# Altium project EXCHANGEDISPLAY.PRJPCB
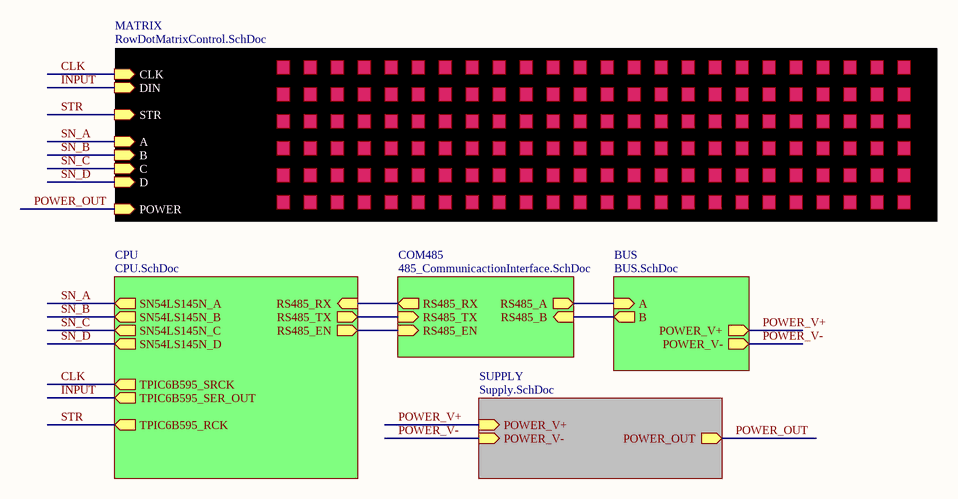
[diagram p0: ExchangeDisplay.SchDoc]
10 sheets, 256 parts. Net scope: hierarchical (ports join the sheet entries above them; power ports are global).
Board file: BAZ-DOTMATRIX-01R03.PcbDoc
Sheets:
  ExchangeDisplay.SchDoc
    CPU = CPU.SchDoc
    COM485 = 485_CommunicactionInterface.SchDoc
    MATRIX = RowDotMatrixControl.SchDoc
      RowCtrl = SN54LS145N_CommunicationInterface.SchDoc
      Row = RowDotMatrix.SchDoc
      Row = RowDotMatrix.SchDoc
      Row = RowDotMatrix.SchDoc
      Row = RowDotMatrix.SchDoc
      Row = RowDotMatrix.SchDoc
      Row = RowDotMatrix.SchDoc
      Row = RowDotMatrix.SchDoc
      REG = TPIC6B595_CommunicationInterface.SchDoc
      REG = TPIC6B595_CommunicationInterface.SchDoc
      REG = TPIC6B595_CommunicationInterface.SchDoc
    BUS = BUS.SchDoc
      BUS = BUSConnector.SchDoc
      BUS = BUSConnector.SchDoc
    SUPPLY = Supply.SchDoc

## Sheet ExchangeDisplay.SchDoc
size A4

### Sub-sheets
BUS = BUS.SchDoc: A (in), B (out), POWER_V+ (out), POWER_V- (out)
COM485 = 485_CommunicactionInterface.SchDoc: RS485_RX (out), RS485_TX (in), RS485_EN (in), RS485_A (out), RS485_B (in)
CPU = CPU.SchDoc: RS485_RX (in), RS485_TX (out), RS485_EN (out), TPIC6B595_SRCK (out), TPIC6B595_SER_OUT (out), TPIC6B595_RCK (out), SN54LS145N_A (out), SN54LS145N_B (out), SN54LS145N_C (out), SN54LS145N_D (out)
MATRIX = RowDotMatrixControl.SchDoc: CLK (in), DIN (in), STR (in), POWER (in), A (in), B (in), C (in), D (in)
SUPPLY = Supply.SchDoc: POWER_V+ (in), POWER_V- (in), POWER_OUT (out)

### Nets
A: sheet COM485/RS485_A, sheet BUS/A
B: sheet COM485/RS485_B, sheet BUS/B
CLK: sheet CPU/TPIC6B595_SRCK, sheet MATRIX/CLK
COM_485_EN: sheet CPU/RS485_EN, sheet COM485/RS485_EN
DI: sheet CPU/RS485_TX, sheet COM485/RS485_TX
INPUT: sheet CPU/TPIC6B595_SER_OUT, sheet MATRIX/DIN
POWER_OUT: sheet MATRIX/POWER, sheet SUPPLY/POWER_OUT  [project net EXTSUPP]
POWER_V+: sheet BUS/POWER_V+, sheet SUPPLY/POWER_V+
POWER_V-: sheet BUS/POWER_V-, sheet SUPPLY/POWER_V-
RO: sheet CPU/RS485_RX, sheet COM485/RS485_RX
SN_A: sheet CPU/SN54LS145N_A, sheet MATRIX/A  [project net PIN_A]
SN_B: sheet CPU/SN54LS145N_B, sheet MATRIX/B  [project net PIN_B]
SN_C: sheet CPU/SN54LS145N_C, sheet MATRIX/C  [project net PIN_C]
SN_D: sheet CPU/SN54LS145N_D, sheet MATRIX/D  [project net PIN_D]
STR: sheet CPU/TPIC6B595_RCK, sheet MATRIX/STR  [project net RCK]

## Sheet CPU.SchDoc
size A4
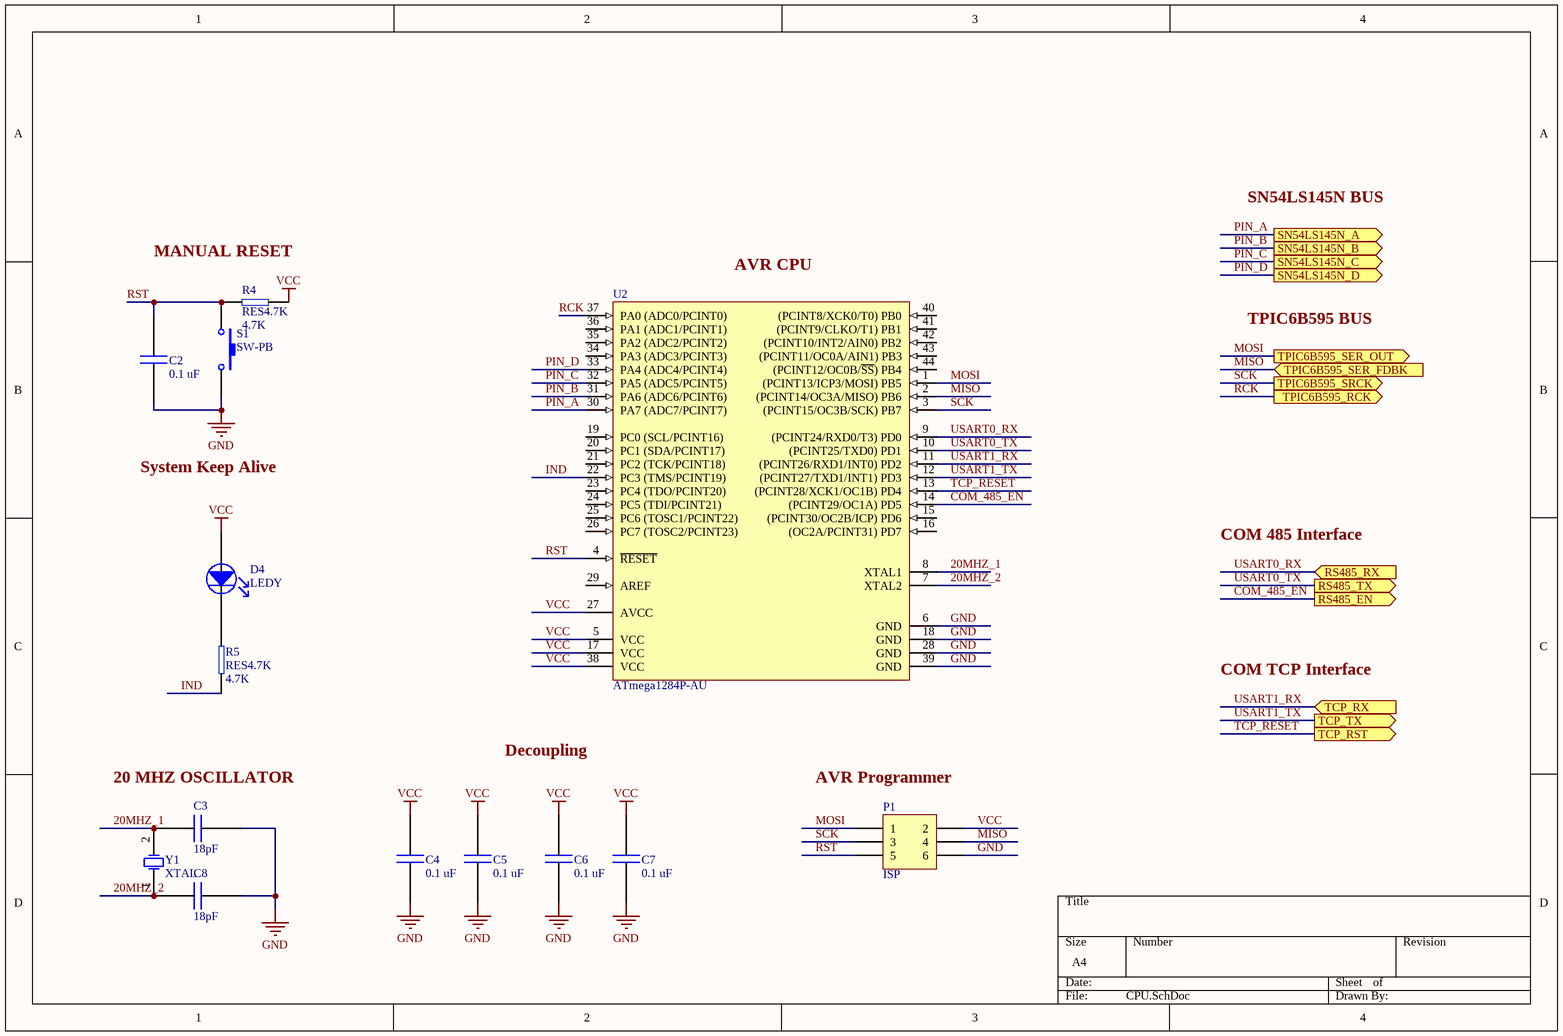
[diagram p1: CPU.SchDoc]

### Parts
C2  value 0.1 uF  [CAP0603]  (hidden comment: CAP0.1uF)
C3  value 18pF  [CAP0603]  (hidden comment: CAP18pF)
C4  value 0.1 uF  [CAP0603]  (hidden comment: CAP0.1uF)
C5  value 0.1 uF  [CAP0603]  (hidden comment: CAP0.1uF)
C6  value 0.1 uF  [CAP0603]  (hidden comment: CAP0.1uF)
C7  value 0.1 uF  [CAP0603]  (hidden comment: CAP0.1uF)
C8  value 18pF  [CAP0603]  (hidden comment: CAP18pF)
D4  LEDY  [150060YS75000]
P1  ISP  [HDR2X3]
R4  RES4.7K  value 4.7K  [RES0603]
R5  RES4.7K  value 4.7K  [RES0603]
S1  SW-PB  [microswitch]
U2  ATmega1284P-AU  [44A_N]
Y1  XTAL  [Crystal20MHz]

### Ports
RS485_EN (out), RS485_RX (in), RS485_TX (out), SN54LS145N_A (out), SN54LS145N_B (out), SN54LS145N_C (out), SN54LS145N_D (out), TCP_RST (out), TCP_RX (in), TCP_TX (out), TPIC6B595_RCK (out), TPIC6B595_SER_FDBK (in), TPIC6B595_SER_OUT (out), TPIC6B595_SRCK (out)

### Nets
GND: C2.2 C3.2 C4.2 C5.2 C6.2 C7.2 C8.2 P1.6 S1.2 U2.6(GND) U2.18(GND) U2.28(GND) U2.39(GND)
VCC: C4.1 C5.1 C6.1 C7.1 D4.2(Anode) P1.2 R4.2(neg) U2.5(VCC) U2.17(VCC) U2.27(AVCC) U2.38(VCC)
20MHZ_1: C3.1 U2.8(XTAL1) Y1.2(OSC2)
20MHZ_2: C8.1 U2.7(XTAL2) Y1.1(OSC1)
COM_485_EN: U2.14((PCINT29/OC1A)_PD5) ; port RS485_EN
IND: R5.1(pos) U2.22(PC3_(TMS/PCINT19))
MISO: P1.4 U2.2((PCINT14/OC3A/MISO)_PB6) ; port TPIC6B595_SER_FDBK
MOSI: P1.1 U2.1((PCINT13/ICP3/MOSI)_PB5) ; port TPIC6B595_SER_OUT  [project net INPUT]
PIN_A: U2.30(PA7_(ADC7/PCINT7)) ; port SN54LS145N_A
PIN_B: U2.31(PA6_(ADC6/PCINT6)) ; port SN54LS145N_B
PIN_C: U2.32(PA5_(ADC5/PCINT5)) ; port SN54LS145N_C
PIN_D: U2.33(PA4_(ADC4/PCINT4)) ; port SN54LS145N_D
RCK: U2.37(PA0_(ADC0/PCINT0)) ; port TPIC6B595_RCK
RST: C2.1 P1.5 R4.1(pos) S1.1 U2.4(~{RESET})
SCK: P1.3 U2.3((PCINT15/OC3B/SCK)_PB7) ; port TPIC6B595_SRCK  [project net CLK]
TCP_RESET: U2.13((PCINT28/XCK1/OC1B)_PD4) ; port TCP_RST
USART0_RX: U2.9((PCINT24/RXD0/T3)_PD0) ; port RS485_RX  [project net RO]
USART0_TX: U2.10((PCINT25/TXD0)_PD1) ; port RS485_TX  [project net DI]
USART1_RX: U2.11((PCINT26/RXD1/INT0)_PD2) ; port TCP_RX
USART1_TX: U2.12((PCINT27/TXD1/INT1)_PD3) ; port TCP_TX
NetD4_1: D4.1(Cathode) R5.2(neg)

Not connected (* = marked no-connect by the designer): U2 15((PCINT30/OC2B/ICP)_PD6) 16((OC2A/PCINT31)_PD7) 19(PC0_(SCL/PCINT16)) 20(PC1_(SDA/PCINT17)) 21(PC2_(TCK/PCINT18)) 23(PC4_(TDO/PCINT20)) 24(PC5_(TDI/PCINT21)) 25(PC6_(TOSC1/PCINT22)) 26(PC7_(TOSC2/PCINT23)) 29(AREF) 34(PA3_(ADC3/PCINT3)) 35(PA2_(ADC2/PCINT2)) 36(PA1_(ADC1/PCINT1)) 40((PCINT8/XCK0/T0)_PB0) 41((PCINT9/CLKO/T1)_PB1) 42((PCINT10/INT2/AIN0)_PB2) 43((PCINT11/OC0A/AIN1)_PB3) 44((PCINT12/OC0B/~{SS})_PB4)

### Notes on the sheet
- Labels drawn without touching a wire or pin: 20 MHZ OSCILLATOR, AVR CPU, AVR Programmer, COM 485 Interface, COM TCP Interface, Decoupling, MANUAL RESET, SN54LS145N BUS, System Keep Alive, TPIC6B595 BUS

### Library data of the parts
C2 C4-C7 = C0.1UF: Capacitores cerámicos de capas múltiples (MLCC) - SMD/SMT 0603 0.1uF 16volts X7R 5%; MPN: VJ0603Y104JXJPW1BC; Supplier PN: 77-VJ0603Y104JXJPBC; Supplier: Mouser
C3 C8 = CAP18pF: Capacitores cerámicos de capas múltiples (MLCC) - SMD/SMT 0603 18pF 50volts C0G 5%; MPN: GRM1885C1H180JA01D; Supplier: Mouser; Supplier PN: 81-GRM39C180J50
D4 = LEDY: LED estándar - SMD (montaje superficial) WL-SMCW SMDMono TpVw Waterclr 0603 Yellow; Supplier: Mouser; Supplier PN: 710-150060YS75000; MPN: 150060YS75000; Value: Yellow
P1 = Header 3X2: Alojamientos de cables y cabecera 2X03P DUAL ROW; MPN: 826925-3; Value: 6 POS; Supplier: Mouser; Supplier PN: 571-826925-3
R4 R5 = RES4.7K: Resistores de película gruesa - SMD 1/10watt 4.7Kohms 1%; MPN: CRCW06034K70FKEA; Supplier PN: 71-CRCW0603-4.7K-E3; Supplier: Mouser
S1 = SW-PB: Switch; MPN: PTS635SL43SMTR LFS; Value: OFF - (ON); Supplier: Mouser; Supplier PN: 611-PTS635SL43SMTRLF
U2 = ATmega1284P-AU: 20 MHz 8-bit AVR Microcontroller with 128KB Flash, 44-Pin TQFP Pkg, Industrial Temp; Supplier: Mouser; Supplier PN: 556-ATMEGA1284P-AU; MPN: ATMEGA1284P-AU; Value: ATMEGA1284P
Y1 = XTAL: Cristales 20MHz 16pF -10C +70C; MPN: ECS-200-16-5PX-TR; Supplier: Mouser; Supplier PN: 520-ECS-200-16-5PX-T; Value: 20 MHz

## Sheet 485_CommunicactionInterface.SchDoc
size A4
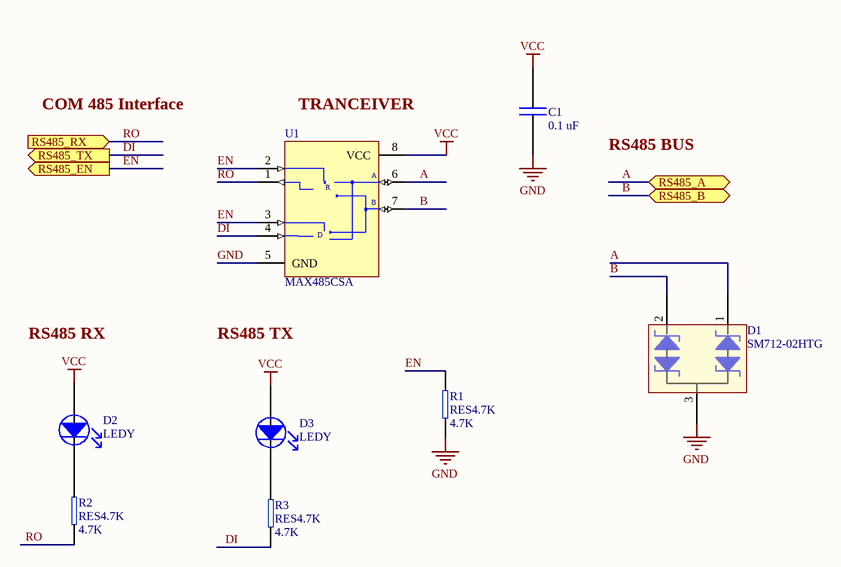
[diagram p2: 485_CommunicactionInterface.SchDoc]

### Parts
C1  value 0.1 uF  [CAP0603]  (hidden comment: CAP0.1uF)
D1  SM712-02HTG  [SW712]
D2  LEDY  [150060YS75000]
D3  LEDY  [150060YS75000]
R1  RES4.7K  value 4.7K  [RES0603]
R2  RES4.7K  value 4.7K  [RES0603]
R3  RES4.7K  value 4.7K  [RES0603]
U1  MAX485CSA  [NSO8_N]

### Ports
RS485_A (bidir), RS485_B (bidir), RS485_EN (out), RS485_RX (in), RS485_TX (out)

### Nets
GND: C1.2 D1.3 R1.2(neg) U1.5(GND)
VCC: C1.1 D2.2(Anode) D3.2(Anode) U1.8(VCC)
A: D1.1 U1.6(A) ; port RS485_A
B: D1.2 U1.7(B) ; port RS485_B
DI: R3.2(neg) U1.4(DI) ; port RS485_TX
EN: R1.1(pos) U1.2(~{RE}) U1.3(DE) ; port RS485_EN  [project net COM_485_EN]
RO: R2.2(neg) U1.1(RO) ; port RS485_RX
NetD2_1: D2.1(Cathode) R2.1(pos)
NetD3_1: D3.1(Cathode) R3.1(pos)

### Notes on the sheet
- Labels drawn without touching a wire or pin: COM 485 Interface, RS485 BUS, RS485 RX, RS485 TX, TRANCEIVER
- (in symbol MAX485CSA) R; D

### Library data of the parts
C1 = C0.1UF: as C2 on sheet CPU; Supplier PN: 77-VJ0603Y104JXJPBC; Supplier: Mouser
D1 = SM712-02HTG: Secuencias de diodos de TVS 600W 2 Channel Green Asymmetrical SOT23-3 (- 7 V to + 12 V); Supplier: Mouser; Supplier PN: 576-SM712-02HTG; MPN: SM712-02HTG; Value: TVS 600W
D2 D3 = LEDY: as D4 on sheet CPU; Supplier: Mouser; Supplier PN: 710-150060YS75000; MPN: 150060YS75000; Value: Yellow
R1-R3 = RES4.7K: as R4 on sheet CPU; Supplier PN: 71-CRCW0603-4.7K-E3; Supplier: Mouser
U1 = MAX485CSA: Low-Power, Slew-Rate-Limited RS-485/RS-422 Transceiver; MPN: MAX485CSA+; Value: RS485; Supplier: Mouser; Supplier PN: 700-MAX485CSA

## Sheet RowDotMatrixControl.SchDoc
size A4
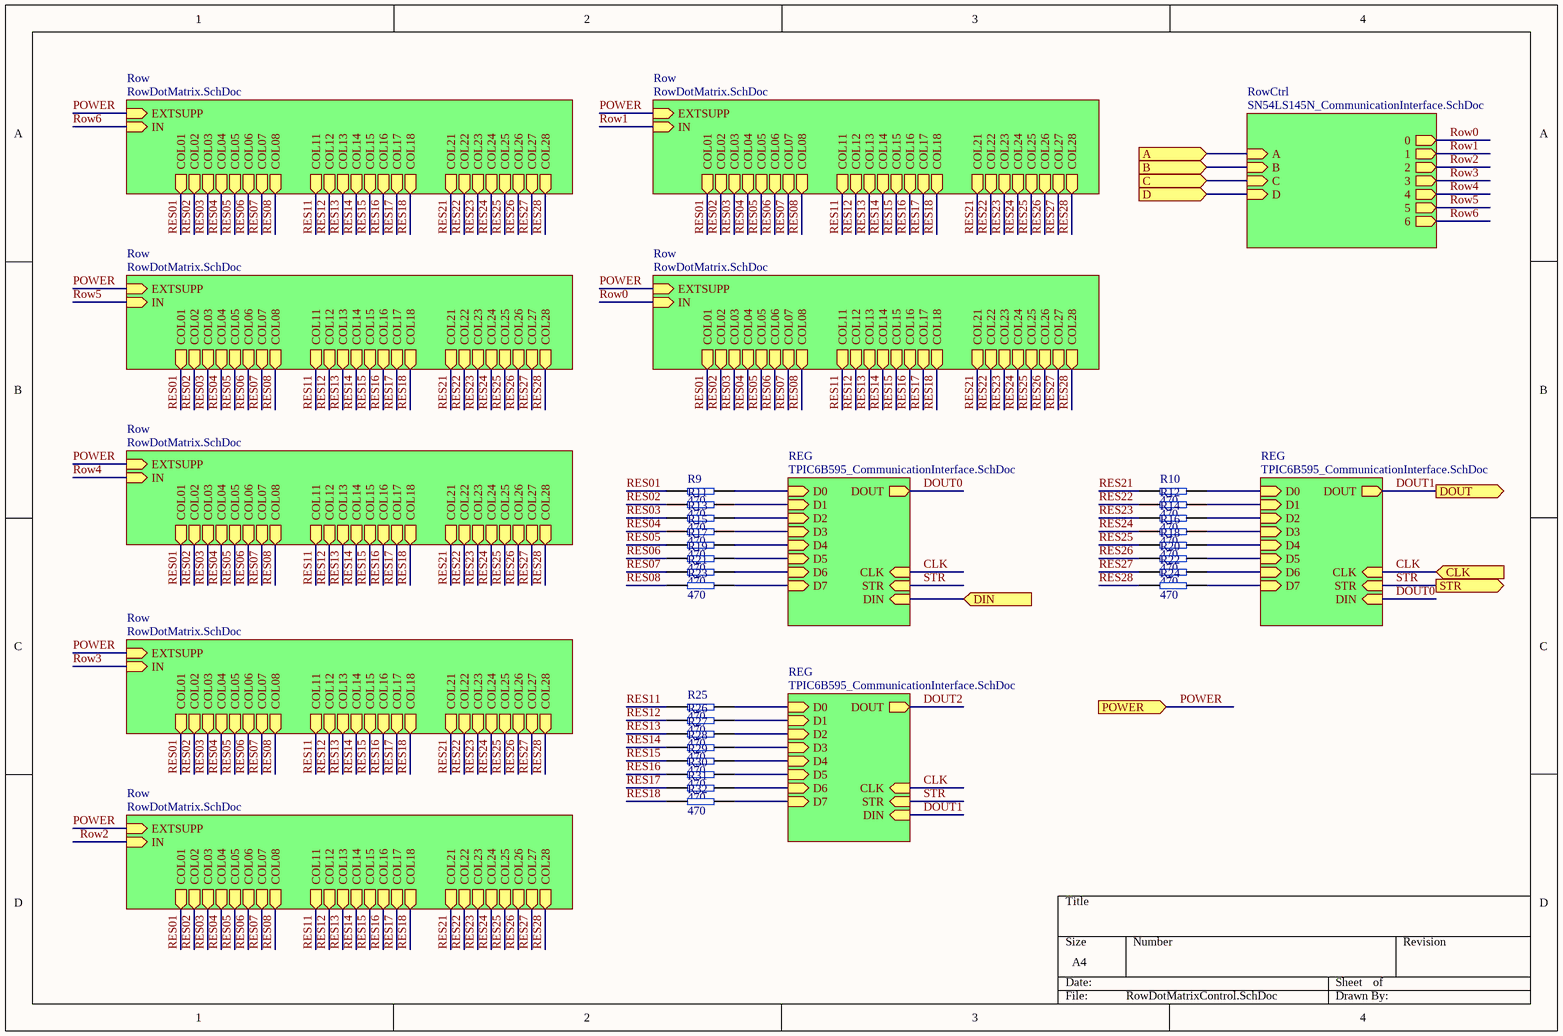
[diagram p3: RowDotMatrixControl.SchDoc]

### Parts
R9  value 470  [RES2512]  (hidden comment: RES470)
R10  value 470  [RES2512]  (hidden comment: RES470)
R11  value 470  [RES2512]  (hidden comment: RES470)
R12  value 470  [RES2512]  (hidden comment: RES470)
R13  value 470  [RES2512]  (hidden comment: RES470)
R14  value 470  [RES2512]  (hidden comment: RES470)
R15  value 470  [RES2512]  (hidden comment: RES470)
R16  value 470  [RES2512]  (hidden comment: RES470)
R17  value 470  [RES2512]  (hidden comment: RES470)
R18  value 470  [RES2512]  (hidden comment: RES470)
R19  value 470  [RES2512]  (hidden comment: RES470)
R20  value 470  [RES2512]  (hidden comment: RES470)
R21  value 470  [RES2512]  (hidden comment: RES470)
R22  value 470  [RES2512]  (hidden comment: RES470)
R23  value 470  [RES2512]  (hidden comment: RES470)
R24  value 470  [RES2512]  (hidden comment: RES470)
R25  value 470  [RES2512]  (hidden comment: RES470)
R26  value 470  [RES2512]  (hidden comment: RES470)
R27  value 470  [RES2512]  (hidden comment: RES470)
R28  value 470  [RES2512]  (hidden comment: RES470)
R29  value 470  [RES2512]  (hidden comment: RES470)
R30  value 470  [RES2512]  (hidden comment: RES470)
R31  value 470  [RES2512]  (hidden comment: RES470)
R32  value 470  [RES2512]  (hidden comment: RES470)

### Sub-sheets
REG = TPIC6B595_CommunicationInterface.SchDoc: D0 (in), D1 (in), D2 (in), D3 (in), D4 (in), D5 (in), D6 (in), D7 (in), DIN (in), DOUT (out), STR (in), CLK (in)
REG = TPIC6B595_CommunicationInterface.SchDoc: D0 (in), D1 (in), D2 (in), D3 (in), D4 (in), D5 (in), D6 (in), D7 (in), DIN (in), DOUT (out), STR (in), CLK (in)
REG = TPIC6B595_CommunicationInterface.SchDoc: D0 (in), D1 (in), D2 (in), D3 (in), D4 (in), D5 (in), D6 (in), D7 (in), DIN (in), DOUT (out), STR (in), CLK (in)
Row = RowDotMatrix.SchDoc: EXTSUPP (in), COL01 (out), COL02 (out), COL03 (out), COL04 (out), COL05 (out), COL06 (out), COL07 (out), COL08 (out), COL11 (out), COL12 (out), COL13 (out), COL14 (out), COL15 (out), COL16 (out), COL17 (out), COL18 (out), COL21 (out), COL22 (out), COL23 (out), COL24 (out), COL25 (out), COL26 (out), COL27 (out), COL28 (out), IN (in)
Row = RowDotMatrix.SchDoc: EXTSUPP (in), COL01 (out), COL02 (out), COL03 (out), COL04 (out), COL05 (out), COL06 (out), COL07 (out), COL08 (out), COL11 (out), COL12 (out), COL13 (out), COL14 (out), COL15 (out), COL16 (out), COL17 (out), COL18 (out), COL21 (out), COL22 (out), COL23 (out), COL24 (out), COL25 (out), COL26 (out), COL27 (out), COL28 (out), IN (in)
Row = RowDotMatrix.SchDoc: EXTSUPP (in), COL01 (out), COL02 (out), COL03 (out), COL04 (out), COL05 (out), COL06 (out), COL07 (out), COL08 (out), COL11 (out), COL12 (out), COL13 (out), COL14 (out), COL15 (out), COL16 (out), COL17 (out), COL18 (out), COL21 (out), COL22 (out), COL23 (out), COL24 (out), COL25 (out), COL26 (out), COL27 (out), COL28 (out), IN (in)
Row = RowDotMatrix.SchDoc: EXTSUPP (in), COL01 (out), COL02 (out), COL03 (out), COL04 (out), COL05 (out), COL06 (out), COL07 (out), COL08 (out), COL11 (out), COL12 (out), COL13 (out), COL14 (out), COL15 (out), COL16 (out), COL17 (out), COL18 (out), COL21 (out), COL22 (out), COL23 (out), COL24 (out), COL25 (out), COL26 (out), COL27 (out), COL28 (out), IN (in)
Row = RowDotMatrix.SchDoc: EXTSUPP (in), COL01 (out), COL02 (out), COL03 (out), COL04 (out), COL05 (out), COL06 (out), COL07 (out), COL08 (out), COL11 (out), COL12 (out), COL13 (out), COL14 (out), COL15 (out), COL16 (out), COL17 (out), COL18 (out), COL21 (out), COL22 (out), COL23 (out), COL24 (out), COL25 (out), COL26 (out), COL27 (out), COL28 (out), IN (in)
Row = RowDotMatrix.SchDoc: EXTSUPP (in), COL01 (out), COL02 (out), COL03 (out), COL04 (out), COL05 (out), COL06 (out), COL07 (out), COL08 (out), COL11 (out), COL12 (out), COL13 (out), COL14 (out), COL15 (out), COL16 (out), COL17 (out), COL18 (out), COL21 (out), COL22 (out), COL23 (out), COL24 (out), COL25 (out), COL26 (out), COL27 (out), COL28 (out), IN (in)
Row = RowDotMatrix.SchDoc: EXTSUPP (in), COL01 (out), COL02 (out), COL03 (out), COL04 (out), COL05 (out), COL06 (out), COL07 (out), COL08 (out), COL11 (out), COL12 (out), COL13 (out), COL14 (out), COL15 (out), COL16 (out), COL17 (out), COL18 (out), COL21 (out), COL22 (out), COL23 (out), COL24 (out), COL25 (out), COL26 (out), COL27 (out), COL28 (out), IN (in)
RowCtrl = SN54LS145N_CommunicationInterface.SchDoc: A (in), B (in), C (in), D (in), 0 (out), 1 (out), 2 (out), 3 (out), 4 (out), 5 (out), 6 (out)

### Ports
A (in), B (in), C (in), CLK (in), D (in), DIN (in), DOUT (out), POWER (in), STR (out)

### Nets
CLK: port CLK, sheet REG/CLK, sheet REG/CLK, sheet REG/CLK
DOUT0: sheet REG/DOUT, sheet REG/DIN
DOUT1: port DOUT, sheet REG/DIN, sheet REG/DOUT
INPUT: port DIN, sheet REG/DIN
PIN_A: port A, sheet RowCtrl/A
PIN_B: port B, sheet RowCtrl/B
PIN_C: port C, sheet RowCtrl/C
PIN_D: port D, sheet RowCtrl/D
POWER: port POWER, sheet Row/EXTSUPP, sheet Row/EXTSUPP, sheet Row/EXTSUPP, sheet Row/EXTSUPP, sheet Row/EXTSUPP, sheet Row/EXTSUPP, sheet Row/EXTSUPP  [project net EXTSUPP]
RES01: R9.1(pos) ; sheet Row/COL01, sheet Row/COL01, sheet Row/COL01, sheet Row/COL01, sheet Row/COL01, sheet Row/COL01, sheet Row/COL01
RES02: R11.1(pos) ; sheet Row/COL02, sheet Row/COL02, sheet Row/COL02, sheet Row/COL02, sheet Row/COL02, sheet Row/COL02, sheet Row/COL02
RES03: R13.1(pos) ; sheet Row/COL03, sheet Row/COL03, sheet Row/COL03, sheet Row/COL03, sheet Row/COL03, sheet Row/COL03, sheet Row/COL03
RES04: R15.1(pos) ; sheet Row/COL04, sheet Row/COL04, sheet Row/COL04, sheet Row/COL04, sheet Row/COL04, sheet Row/COL04, sheet Row/COL04
RES05: R17.1(pos) ; sheet Row/COL05, sheet Row/COL05, sheet Row/COL05, sheet Row/COL05, sheet Row/COL05, sheet Row/COL05, sheet Row/COL05
RES06: R19.1(pos) ; sheet Row/COL06, sheet Row/COL06, sheet Row/COL06, sheet Row/COL06, sheet Row/COL06, sheet Row/COL06, sheet Row/COL06
RES07: R21.1(pos) ; sheet Row/COL07, sheet Row/COL07, sheet Row/COL07, sheet Row/COL07, sheet Row/COL07, sheet Row/COL07, sheet Row/COL07
RES08: R23.1(pos) ; sheet Row/COL08, sheet Row/COL08, sheet Row/COL08, sheet Row/COL08, sheet Row/COL08, sheet Row/COL08, sheet Row/COL08
RES11: R25.1(pos) ; sheet Row/COL11, sheet Row/COL11, sheet Row/COL11, sheet Row/COL11, sheet Row/COL11, sheet Row/COL11, sheet Row/COL11
RES12: R26.1(pos) ; sheet Row/COL12, sheet Row/COL12, sheet Row/COL12, sheet Row/COL12, sheet Row/COL12, sheet Row/COL12, sheet Row/COL12
RES13: R27.1(pos) ; sheet Row/COL13, sheet Row/COL13, sheet Row/COL13, sheet Row/COL13, sheet Row/COL13, sheet Row/COL13, sheet Row/COL13
RES14: R28.1(pos) ; sheet Row/COL14, sheet Row/COL14, sheet Row/COL14, sheet Row/COL14, sheet Row/COL14, sheet Row/COL14, sheet Row/COL14
RES15: R29.1(pos) ; sheet Row/COL15, sheet Row/COL15, sheet Row/COL15, sheet Row/COL15, sheet Row/COL15, sheet Row/COL15, sheet Row/COL15
RES16: R30.1(pos) ; sheet Row/COL16, sheet Row/COL16, sheet Row/COL16, sheet Row/COL16, sheet Row/COL16, sheet Row/COL16, sheet Row/COL16
RES17: R31.1(pos) ; sheet Row/COL17, sheet Row/COL17, sheet Row/COL17, sheet Row/COL17, sheet Row/COL17, sheet Row/COL17, sheet Row/COL17
RES18: R32.1(pos) ; sheet Row/COL18, sheet Row/COL18, sheet Row/COL18, sheet Row/COL18, sheet Row/COL18, sheet Row/COL18, sheet Row/COL18
RES21: R10.1(pos) ; sheet Row/COL21, sheet Row/COL21, sheet Row/COL21, sheet Row/COL21, sheet Row/COL21, sheet Row/COL21, sheet Row/COL21
RES22: R12.1(pos) ; sheet Row/COL22, sheet Row/COL22, sheet Row/COL22, sheet Row/COL22, sheet Row/COL22, sheet Row/COL22, sheet Row/COL22
RES23: R14.1(pos) ; sheet Row/COL23, sheet Row/COL23, sheet Row/COL23, sheet Row/COL23, sheet Row/COL23, sheet Row/COL23, sheet Row/COL23
RES24: R16.1(pos) ; sheet Row/COL24, sheet Row/COL24, sheet Row/COL24, sheet Row/COL24, sheet Row/COL24, sheet Row/COL24, sheet Row/COL24
RES25: R18.1(pos) ; sheet Row/COL25, sheet Row/COL25, sheet Row/COL25, sheet Row/COL25, sheet Row/COL25, sheet Row/COL25, sheet Row/COL25
RES26: R20.1(pos) ; sheet Row/COL26, sheet Row/COL26, sheet Row/COL26, sheet Row/COL26, sheet Row/COL26, sheet Row/COL26, sheet Row/COL26
RES27: R22.1(pos) ; sheet Row/COL27, sheet Row/COL27, sheet Row/COL27, sheet Row/COL27, sheet Row/COL27, sheet Row/COL27, sheet Row/COL27
RES28: R24.1(pos) ; sheet Row/COL28, sheet Row/COL28, sheet Row/COL28, sheet Row/COL28, sheet Row/COL28, sheet Row/COL28, sheet Row/COL28
Row0: sheet RowCtrl/0, sheet Row/IN
Row1: sheet RowCtrl/1, sheet Row/IN
Row2: sheet RowCtrl/2, sheet Row/IN
Row3: sheet RowCtrl/3, sheet Row/IN
Row4: sheet RowCtrl/4, sheet Row/IN
Row5: sheet RowCtrl/5, sheet Row/IN
Row6: sheet RowCtrl/6, sheet Row/IN
STR: port STR, sheet REG/STR, sheet REG/STR, sheet REG/STR  [project net RCK]
NetR9_2: R9.2(neg) ; sheet REG/D0
NetR10_2: R10.2(neg) ; sheet REG/D0
NetR11_2: R11.2(neg) ; sheet REG/D1
NetR12_2: R12.2(neg) ; sheet REG/D1
NetR13_2: R13.2(neg) ; sheet REG/D2
NetR14_2: R14.2(neg) ; sheet REG/D2
NetR15_2: R15.2(neg) ; sheet REG/D3
NetR16_2: R16.2(neg) ; sheet REG/D3
NetR17_2: R17.2(neg) ; sheet REG/D4
NetR18_2: R18.2(neg) ; sheet REG/D4
NetR19_2: R19.2(neg) ; sheet REG/D5
NetR20_2: R20.2(neg) ; sheet REG/D5
NetR21_2: R21.2(neg) ; sheet REG/D6
NetR22_2: R22.2(neg) ; sheet REG/D6
NetR23_2: R23.2(neg) ; sheet REG/D7
NetR24_2: R24.2(neg) ; sheet REG/D7
NetR25_2: R25.2(neg) ; sheet REG/D0
NetR26_2: R26.2(neg) ; sheet REG/D1
NetR27_2: R27.2(neg) ; sheet REG/D2
NetR28_2: R28.2(neg) ; sheet REG/D3
NetR29_2: R29.2(neg) ; sheet REG/D4
NetR30_2: R30.2(neg) ; sheet REG/D5
NetR31_2: R31.2(neg) ; sheet REG/D6
NetR32_2: R32.2(neg) ; sheet REG/D7

### Library data of the parts
R9-R32 = RES470: Resistores de película gruesa - SMD 1watt 470ohms 5%; MPN: CRCW2512470RJNEG; Supplier: Mouser; Supplier PN: 71-CRCW2512J-470-E3

## Sheet SN54LS145N_CommunicationInterface.SchDoc
size A4
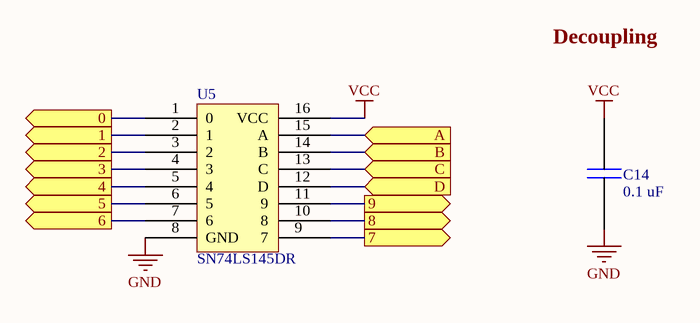
[diagram p4: SN54LS145N_CommunicationInterface.SchDoc]

### Parts
C14  value 0.1 uF  [CAP0603]  (hidden comment: CAP0.1uF)
U5  SN74LS145DR  [SOIC16]

### Ports
0 (out), 1 (out), 2 (out), 3 (out), 4 (out), 5 (out), 6 (out), 7 (out), 8 (out), 9 (out), A (in), B (in), C (in), D (in)

### Nets
GND: C14.2 U5.8(GND)
VCC: C14.1 U5.16(VCC)
PIN_A: U5.15(A) ; port A
PIN_B: U5.14(B) ; port B
PIN_C: U5.13(C) ; port C
PIN_D: U5.12(D) ; port D
Row0: U5.1(0) ; port 0
Row1: U5.2(1) ; port 1
Row2: U5.3(2) ; port 2
Row3: U5.4(3) ; port 3
Row4: U5.5(4) ; port 4
Row5: U5.6(5) ; port 5
Row6: U5.7(6) ; port 6
NetU5_9: U5.9(7) ; port 7
NetU5_10: U5.10(8) ; port 8
NetU5_11: U5.11(9) ; port 9

### Notes on the sheet
- Labels drawn without touching a wire or pin: Decoupling

### Library data of the parts
C14 = C0.1UF: as C2 on sheet CPU; Supplier PN: 77-VJ0603Y104JXJPBC; Supplier: Mouser
U5 = SN74LS145DR: Codificadores, decodificadores, multiplexores y demultiplexores BCD-To-Decimal Decoders/Drivers; Value: BCD; Supplier: Mouser; Supplier PN: 595-SN74LS145DR; MPN: SN74LS145DR

## Sheet RowDotMatrix.SchDoc
size A4
Used 7 times, as channels MATRIX/Row, MATRIX/Row, MATRIX/Row, MATRIX/Row, MATRIX/Row, MATRIX/Row, MATRIX/Row. Parts and nets are listed once, with the designators drawn on the sheet.
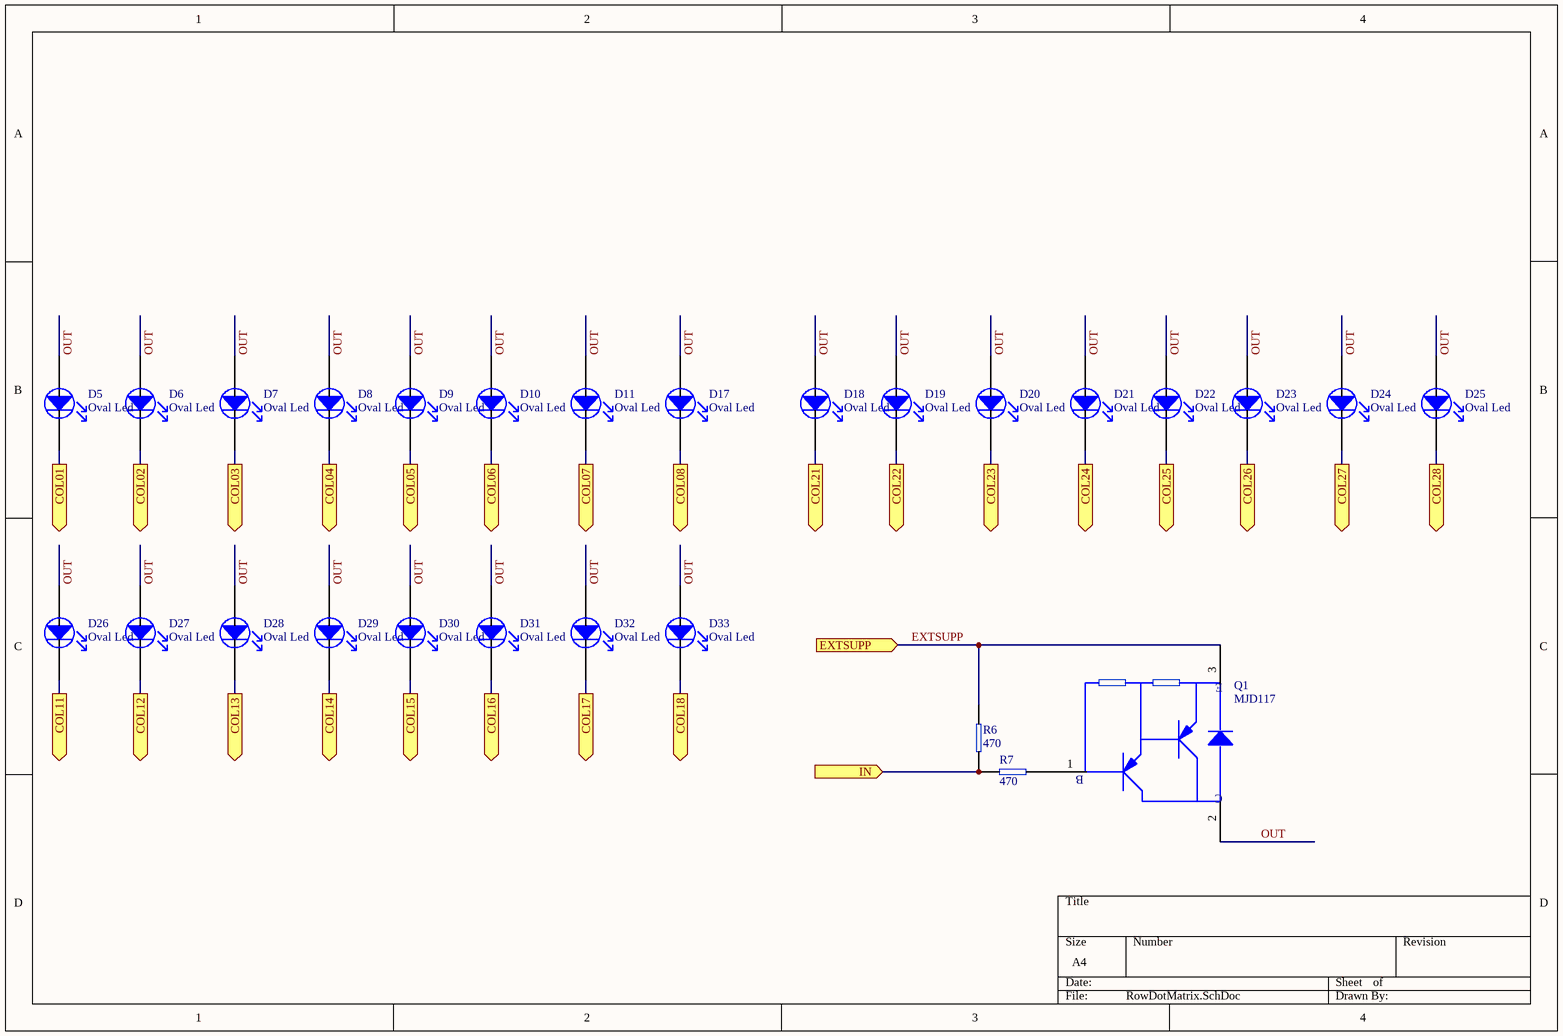
[diagram p5: RowDotMatrix.SchDoc]

### Parts
D5  Oval Led  [LED]
D6  Oval Led  [LED]
D7  Oval Led  [LED]
D8  Oval Led  [LED]
D9  Oval Led  [LED]
D10  Oval Led  [LED]
D11  Oval Led  [LED]
D17  Oval Led  [LED]
D18  Oval Led  [LED]
D19  Oval Led  [LED]
D20  Oval Led  [LED]
D21  Oval Led  [LED]
D22  Oval Led  [LED]
D23  Oval Led  [LED]
D24  Oval Led  [LED]
D25  Oval Led  [LED]
D26  Oval Led  [LED]
D27  Oval Led  [LED]
D28  Oval Led  [LED]
D29  Oval Led  [LED]
D30  Oval Led  [LED]
D31  Oval Led  [LED]
D32  Oval Led  [LED]
D33  Oval Led  [LED]
Q1  MJD117  [MJD117]
R6  value 470  [RES2512]  (hidden comment: RES470)
R7  value 470  [RES2512]  (hidden comment: RES470)

### Ports
COL01 (out), COL02 (out), COL03 (out), COL04 (out), COL05 (out), COL06 (out), COL07 (out), COL08 (out), COL11 (out), COL12 (out), COL13 (out), COL14 (out), COL15 (out), COL16 (out), COL17 (out), COL18 (out), COL21 (out), COL22 (out), COL23 (out), COL24 (out), COL25 (out), COL26 (out), COL27 (out), COL28 (out), EXTSUPP (in), IN (in)

### Nets
COL01: D5.K(Cathode) ; port COL01
COL02: D6.K(Cathode) ; port COL02
COL03: D7.K(Cathode) ; port COL03
COL04: D8.K(Cathode) ; port COL04
COL05: D9.K(Cathode) ; port COL05
COL06: D10.K(Cathode) ; port COL06
COL07: D11.K(Cathode) ; port COL07
COL08: D17.K(Cathode) ; port COL08
COL11: D26.K(Cathode) ; port COL11
COL12: D27.K(Cathode) ; port COL12
COL13: D28.K(Cathode) ; port COL13
COL14: D29.K(Cathode) ; port COL14
COL15: D30.K(Cathode) ; port COL15
COL16: D31.K(Cathode) ; port COL16
COL17: D32.K(Cathode) ; port COL17
COL18: D33.K(Cathode) ; port COL18
COL21: D18.K(Cathode) ; port COL21
COL22: D19.K(Cathode) ; port COL22
COL23: D20.K(Cathode) ; port COL23
COL24: D21.K(Cathode) ; port COL24
COL25: D22.K(Cathode) ; port COL25
COL26: D23.K(Cathode) ; port COL26
COL27: D24.K(Cathode) ; port COL27
COL28: D25.K(Cathode) ; port COL28
EXTSUPP: Q1.3(E) R6.1(pos) ; port EXTSUPP
IN: R6.2(neg) R7.1(pos) ; port IN
OUT: D5.A(Anode) D6.A(Anode) D7.A(Anode) D8.A(Anode) D9.A(Anode) D10.A(Anode) D11.A(Anode) D17.A(Anode) D18.A(Anode) D19.A(Anode) D20.A(Anode) D21.A(Anode) D22.A(Anode) D23.A(Anode) D24.A(Anode) D25.A(Anode) D26.A(Anode) D27.A(Anode) D28.A(Anode) D29.A(Anode) D30.A(Anode) D31.A(Anode) D32.A(Anode) D33.A(Anode) Q1.2(C)
NetQ1_1: Q1.1(B) R7.2(neg)

### Channels
MATRIX/Row: designators D5=D5_MATRIX_Row#1 D6=D6_MATRIX_Row#1 D7=D7_MATRIX_Row#1 D8=D8_MATRIX_Row#1 D9=D9_MATRIX_Row#1 D10=D10_MATRIX_Row#1 D11=D11_MATRIX_Row#1 D17=D17_MATRIX_Row#1 D18=D18_MATRIX_Row#1 D19=D19_MATRIX_Row#1 D20=D20_MATRIX_Row#1 D21=D21_MATRIX_Row#1 D22=D22_MATRIX_Row#1 D23=D23_MATRIX_Row#1 D24=D24_MATRIX_Row#1 D25=D25_MATRIX_Row#1 D26=D26_MATRIX_Row#1 D27=D27_MATRIX_Row#1 D28=D28_MATRIX_Row#1 D29=D29_MATRIX_Row#1 D30=D30_MATRIX_Row#1 D31=D31_MATRIX_Row#1 D32=D32_MATRIX_Row#1 D33=D33_MATRIX_Row#1 Q1=Q1_Row7 R6=R6_Row7 R7=R7_Row7; ports COL01=RES01 COL02=RES02 COL03=RES03 COL04=RES04 COL05=RES05 COL06=RES06 COL07=RES07 COL08=RES08 COL11=RES11 COL12=RES12 COL13=RES13 COL14=RES14 COL15=RES15 COL16=RES16 COL17=RES17 COL18=RES18 COL21=RES21 COL22=RES22 COL23=RES23 COL24=RES24 COL25=RES25 COL26=RES26 COL27=RES27 COL28=RES28 EXTSUPP=EXTSUPP IN=Row6
MATRIX/Row: designators D5=D5_MATRIX_Row#2 D6=D6_MATRIX_Row#2 D7=D7_MATRIX_Row#2 D8=D8_MATRIX_Row#2 D9=D9_MATRIX_Row#2 D10=D10_MATRIX_Row#2 D11=D11_MATRIX_Row#2 D17=D17_MATRIX_Row#2 D18=D18_MATRIX_Row#2 D19=D19_MATRIX_Row#2 D20=D20_MATRIX_Row#2 D21=D21_MATRIX_Row#2 D22=D22_MATRIX_Row#2 D23=D23_MATRIX_Row#2 D24=D24_MATRIX_Row#2 D25=D25_MATRIX_Row#2 D26=D26_MATRIX_Row#2 D27=D27_MATRIX_Row#2 D28=D28_MATRIX_Row#2 D29=D29_MATRIX_Row#2 D30=D30_MATRIX_Row#2 D31=D31_MATRIX_Row#2 D32=D32_MATRIX_Row#2 D33=D33_MATRIX_Row#2 Q1=Q1_Row6 R6=R6_Row6 R7=R7_Row6; ports COL01=RES01 COL02=RES02 COL03=RES03 COL04=RES04 COL05=RES05 COL06=RES06 COL07=RES07 COL08=RES08 COL11=RES11 COL12=RES12 COL13=RES13 COL14=RES14 COL15=RES15 COL16=RES16 COL17=RES17 COL18=RES18 COL21=RES21 COL22=RES22 COL23=RES23 COL24=RES24 COL25=RES25 COL26=RES26 COL27=RES27 COL28=RES28 EXTSUPP=EXTSUPP IN=Row5
MATRIX/Row: designators D5=D5_MATRIX_Row#3 D6=D6_MATRIX_Row#3 D7=D7_MATRIX_Row#3 D8=D8_MATRIX_Row#3 D9=D9_MATRIX_Row#3 D10=D10_MATRIX_Row#3 D11=D11_MATRIX_Row#3 D17=D17_MATRIX_Row#3 D18=D18_MATRIX_Row#3 D19=D19_MATRIX_Row#3 D20=D20_MATRIX_Row#3 D21=D21_MATRIX_Row#3 D22=D22_MATRIX_Row#3 D23=D23_MATRIX_Row#3 D24=D24_MATRIX_Row#3 D25=D25_MATRIX_Row#3 D26=D26_MATRIX_Row#3 D27=D27_MATRIX_Row#3 D28=D28_MATRIX_Row#3 D29=D29_MATRIX_Row#3 D30=D30_MATRIX_Row#3 D31=D31_MATRIX_Row#3 D32=D32_MATRIX_Row#3 D33=D33_MATRIX_Row#3 Q1=Q1_Row5 R6=R6_Row5 R7=R7_Row5; ports COL01=RES01 COL02=RES02 COL03=RES03 COL04=RES04 COL05=RES05 COL06=RES06 COL07=RES07 COL08=RES08 COL11=RES11 COL12=RES12 COL13=RES13 COL14=RES14 COL15=RES15 COL16=RES16 COL17=RES17 COL18=RES18 COL21=RES21 COL22=RES22 COL23=RES23 COL24=RES24 COL25=RES25 COL26=RES26 COL27=RES27 COL28=RES28 EXTSUPP=EXTSUPP IN=Row4
MATRIX/Row: designators D5=D5_MATRIX_Row#4 D6=D6_MATRIX_Row#4 D7=D7_MATRIX_Row#4 D8=D8_MATRIX_Row#4 D9=D9_MATRIX_Row#4 D10=D10_MATRIX_Row#4 D11=D11_MATRIX_Row#4 D17=D17_MATRIX_Row#4 D18=D18_MATRIX_Row#4 D19=D19_MATRIX_Row#4 D20=D20_MATRIX_Row#4 D21=D21_MATRIX_Row#4 D22=D22_MATRIX_Row#4 D23=D23_MATRIX_Row#4 D24=D24_MATRIX_Row#4 D25=D25_MATRIX_Row#4 D26=D26_MATRIX_Row#4 D27=D27_MATRIX_Row#4 D28=D28_MATRIX_Row#4 D29=D29_MATRIX_Row#4 D30=D30_MATRIX_Row#4 D31=D31_MATRIX_Row#4 D32=D32_MATRIX_Row#4 D33=D33_MATRIX_Row#4 Q1=Q1_Row4 R6=R6_Row4 R7=R7_Row4; ports COL01=RES01 COL02=RES02 COL03=RES03 COL04=RES04 COL05=RES05 COL06=RES06 COL07=RES07 COL08=RES08 COL11=RES11 COL12=RES12 COL13=RES13 COL14=RES14 COL15=RES15 COL16=RES16 COL17=RES17 COL18=RES18 COL21=RES21 COL22=RES22 COL23=RES23 COL24=RES24 COL25=RES25 COL26=RES26 COL27=RES27 COL28=RES28 EXTSUPP=EXTSUPP IN=Row3
MATRIX/Row: designators D5=D5_MATRIX_Row#5 D6=D6_MATRIX_Row#5 D7=D7_MATRIX_Row#5 D8=D8_MATRIX_Row#5 D9=D9_MATRIX_Row#5 D10=D10_MATRIX_Row#5 D11=D11_MATRIX_Row#5 D17=D17_MATRIX_Row#5 D18=D18_MATRIX_Row#5 D19=D19_MATRIX_Row#5 D20=D20_MATRIX_Row#5 D21=D21_MATRIX_Row#5 D22=D22_MATRIX_Row#5 D23=D23_MATRIX_Row#5 D24=D24_MATRIX_Row#5 D25=D25_MATRIX_Row#5 D26=D26_MATRIX_Row#5 D27=D27_MATRIX_Row#5 D28=D28_MATRIX_Row#5 D29=D29_MATRIX_Row#5 D30=D30_MATRIX_Row#5 D31=D31_MATRIX_Row#5 D32=D32_MATRIX_Row#5 D33=D33_MATRIX_Row#5 Q1=Q1_Row3 R6=R6_Row3 R7=R7_Row3; ports COL01=RES01 COL02=RES02 COL03=RES03 COL04=RES04 COL05=RES05 COL06=RES06 COL07=RES07 COL08=RES08 COL11=RES11 COL12=RES12 COL13=RES13 COL14=RES14 COL15=RES15 COL16=RES16 COL17=RES17 COL18=RES18 COL21=RES21 COL22=RES22 COL23=RES23 COL24=RES24 COL25=RES25 COL26=RES26 COL27=RES27 COL28=RES28 EXTSUPP=EXTSUPP IN=Row2
MATRIX/Row: designators D5=D5_MATRIX_Row#6 D6=D6_MATRIX_Row#6 D7=D7_MATRIX_Row#6 D8=D8_MATRIX_Row#6 D9=D9_MATRIX_Row#6 D10=D10_MATRIX_Row#6 D11=D11_MATRIX_Row#6 D17=D17_MATRIX_Row#6 D18=D18_MATRIX_Row#6 D19=D19_MATRIX_Row#6 D20=D20_MATRIX_Row#6 D21=D21_MATRIX_Row#6 D22=D22_MATRIX_Row#6 D23=D23_MATRIX_Row#6 D24=D24_MATRIX_Row#6 D25=D25_MATRIX_Row#6 D26=D26_MATRIX_Row#6 D27=D27_MATRIX_Row#6 D28=D28_MATRIX_Row#6 D29=D29_MATRIX_Row#6 D30=D30_MATRIX_Row#6 D31=D31_MATRIX_Row#6 D32=D32_MATRIX_Row#6 D33=D33_MATRIX_Row#6 Q1=Q1_Row2 R6=R6_Row2 R7=R7_Row2; ports COL01=RES01 COL02=RES02 COL03=RES03 COL04=RES04 COL05=RES05 COL06=RES06 COL07=RES07 COL08=RES08 COL11=RES11 COL12=RES12 COL13=RES13 COL14=RES14 COL15=RES15 COL16=RES16 COL17=RES17 COL18=RES18 COL21=RES21 COL22=RES22 COL23=RES23 COL24=RES24 COL25=RES25 COL26=RES26 COL27=RES27 COL28=RES28 EXTSUPP=EXTSUPP IN=Row1
MATRIX/Row: designators D5=D5_MATRIX_Row#7 D6=D6_MATRIX_Row#7 D7=D7_MATRIX_Row#7 D8=D8_MATRIX_Row#7 D9=D9_MATRIX_Row#7 D10=D10_MATRIX_Row#7 D11=D11_MATRIX_Row#7 D17=D17_MATRIX_Row#7 D18=D18_MATRIX_Row#7 D19=D19_MATRIX_Row#7 D20=D20_MATRIX_Row#7 D21=D21_MATRIX_Row#7 D22=D22_MATRIX_Row#7 D23=D23_MATRIX_Row#7 D24=D24_MATRIX_Row#7 D25=D25_MATRIX_Row#7 D26=D26_MATRIX_Row#7 D27=D27_MATRIX_Row#7 D28=D28_MATRIX_Row#7 D29=D29_MATRIX_Row#7 D30=D30_MATRIX_Row#7 D31=D31_MATRIX_Row#7 D32=D32_MATRIX_Row#7 D33=D33_MATRIX_Row#7 Q1=Q1_Row1 R6=R6_Row1 R7=R7_Row1; ports COL01=RES01 COL02=RES02 COL03=RES03 COL04=RES04 COL05=RES05 COL06=RES06 COL07=RES07 COL08=RES08 COL11=RES11 COL12=RES12 COL13=RES13 COL14=RES14 COL15=RES15 COL16=RES16 COL17=RES17 COL18=RES18 COL21=RES21 COL22=RES22 COL23=RES23 COL24=RES24 COL25=RES25 COL26=RES26 COL27=RES27 COL28=RES28 EXTSUPP=EXTSUPP IN=Row0

### Library data of the parts
D5-D11 D17-D33 = Oval Led: LED estándar - Montaje interfacial Red Oval LED; MPN: C566C-RFN-CV0W0BB2; Value: 2200 mcd 70x35 deg; Supplier: Mouser; Supplier PN: 941-C566CRFNCV0W0BB2
Q1 = MJD117: Transistores Darlington PNP Silicon Darl; MPN: MJD117TF; Value: PNP; Supplier: Mouser; Supplier PN: 512-MJD117TF
R6 R7 = RES470: as R9 on sheet RowDotMatrixControl; Supplier: Mouser; Supplier PN: 71-CRCW2512J-470-E3

## Sheet TPIC6B595_CommunicationInterface.SchDoc
size A4
Used 3 times, as channels MATRIX/REG, MATRIX/REG, MATRIX/REG. Parts and nets are listed once, with the designators drawn on the sheet.
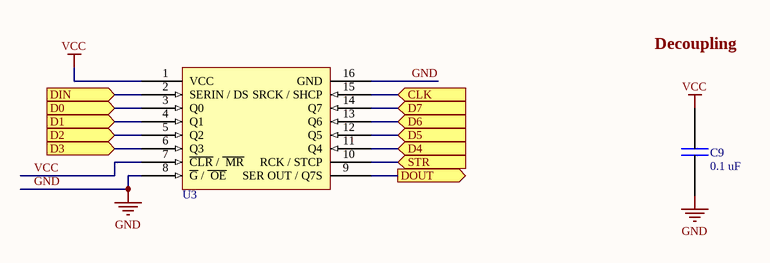
[diagram p6: TPIC6B595_CommunicationInterface.SchDoc]

### Parts
C9  value 0.1 uF  [CAP0603]  (hidden comment: CAP0.1uF)
U3  POWER SHIFT REG  [NPIC6C595_Q100_SOIC16]  (value not drawn)

### Ports
CLK (in), D0 (in), D1 (in), D2 (in), D3 (in), D4 (in), D5 (in), D6 (in), D7 (in), DIN (in), DOUT (out), STR (in)

### Nets
GND: C9.2 U3.8(~{G}_/_~{_OE}) U3.16(GND)
VCC: C9.1 U3.1(VCC) U3.7(~{CLR}_/_~{_MR})
CLK: U3.15(SRCK_/_SHCP) ; port CLK
D0: U3.3(Q0) ; port D0
D1: U3.4(Q1) ; port D1
D2: U3.5(Q2) ; port D2
D3: U3.6(Q3) ; port D3
D4: U3.11(Q4) ; port D4
D5: U3.12(Q5) ; port D5
D6: U3.13(Q6) ; port D6
D7: U3.14(Q7) ; port D7
DIN: U3.2(SERIN_/_DS) ; port DIN
DOUT: U3.9(SER_OUT_/_Q7S) ; port DOUT
STR: U3.10(RCK_/_STCP) ; port STR

### Channels
MATRIX/REG: designators end in _REG3; ports CLK=CLK D0=NetR9_2 D1=NetR11_2 D2=NetR13_2 D3=NetR15_2 D4=NetR17_2 D5=NetR19_2 D6=NetR21_2 D7=NetR23_2 DIN=INPUT DOUT=DOUT0 STR=RCK
MATRIX/REG: designators end in _REG2; ports CLK=CLK D0=NetR25_2 D1=NetR26_2 D2=NetR27_2 D3=NetR28_2 D4=NetR29_2 D5=NetR30_2 D6=NetR31_2 D7=NetR32_2 DIN=DOUT1 DOUT=DOUT2 STR=RCK
MATRIX/REG: designators end in _REG1; ports CLK=CLK D0=NetR10_2 D1=NetR12_2 D2=NetR14_2 D3=NetR16_2 D4=NetR18_2 D5=NetR20_2 D6=NetR22_2 D7=NetR24_2 DIN=DOUT0 DOUT=DOUT1 STR=RCK

### Notes on the sheet
- Labels drawn without touching a wire or pin: Decoupling

### Library data of the parts
C9 = C0.1UF: as C2 on sheet CPU; Supplier PN: 77-VJ0603Y104JXJPBC; Supplier: Mouser
U3 = TPIC6C595DR / NPIC6C595D: Registros de cambio de contadores 8bit Shift; MPN: NPIC6C595D-Q100; Value: 8 bits shift register; Supplier: Mouser; Supplier PN: 771-NPIC6C595D-Q100; Supplier PN1: 595-TPIC6C595DR; MPN1: TPIC6C595DR

## Sheet BUS.SchDoc
size A4
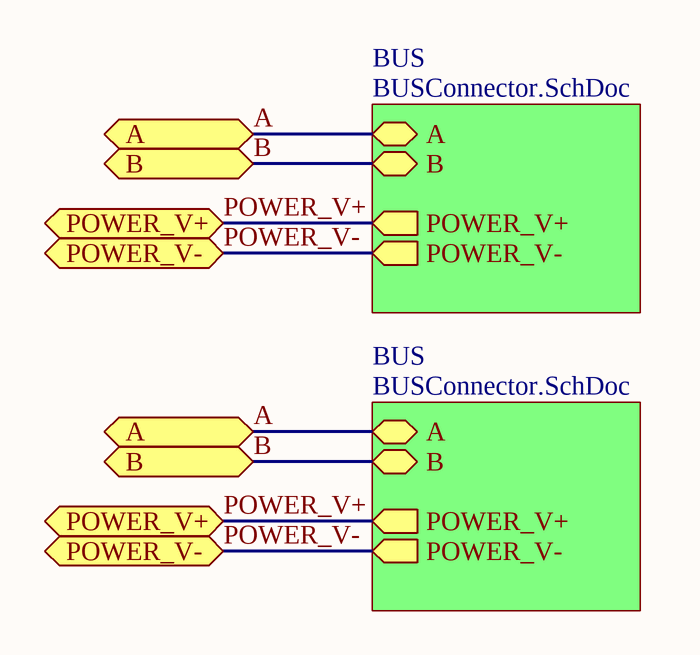
[diagram p7: BUS.SchDoc]

### Sub-sheets
BUS = BUSConnector.SchDoc: A (bidir), B (bidir), POWER_V+ (out), POWER_V- (out)
BUS = BUSConnector.SchDoc: A (bidir), B (bidir), POWER_V+ (out), POWER_V- (out)

### Ports
A, B, POWER_V+, POWER_V-

### Nets
A: port A, sheet BUS/A, sheet BUS/A
B: port B, sheet BUS/B, sheet BUS/B
POWER_V+: port POWER_V+, sheet BUS/POWER_V+, sheet BUS/POWER_V+
POWER_V-: port POWER_V-, sheet BUS/POWER_V-, sheet BUS/POWER_V-

## Sheet BUSConnector.SchDoc
size A4
Used 2 times, as channels BUS/BUS, BUS/BUS. Parts and nets are listed once, with the designators drawn on the sheet.
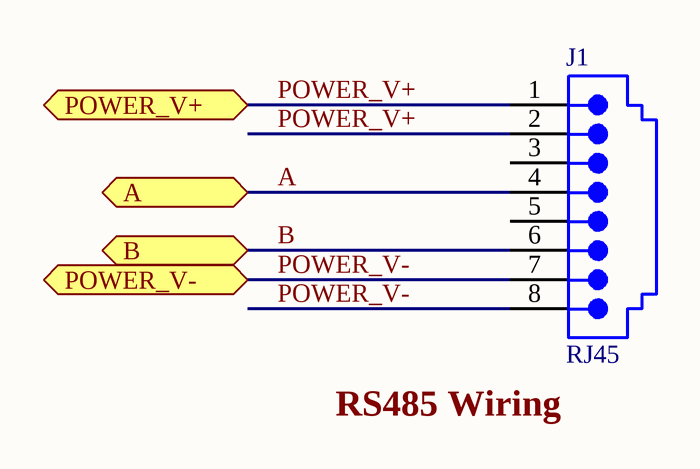
[diagram p8: BUSConnector.SchDoc]

### Parts
J1  RJ45  [15-43-6233]

### Ports
A, B, POWER_V+, POWER_V-

### Nets
A: J1.4 ; port A
B: J1.6 ; port B
POWER_V+: J1.1 J1.2 ; port POWER_V+
POWER_V-: J1.7 J1.8 ; port POWER_V-

Not connected (* = marked no-connect by the designer): J1 3 5

### Channels
BUS/BUS: designators end in _BUS3; ports A=A B=B POWER_V+=POWER_V+ POWER_V-=POWER_V-
BUS/BUS: designators end in _BUS2; ports A=A B=B POWER_V+=POWER_V+ POWER_V-=POWER_V-

### Notes on the sheet
- Labels drawn without touching a wire or pin: RS485 Wiring

### Library data of the parts
J1 = 15-43-6233: Conectores modulares / Conectores Ethernet 8 PCB LO PRO R/A; MPN: 5555164-1; Supplier: Mouser; Supplier PN: 571-5555164-1; Value: RJ45

## Sheet Supply.SchDoc
size A4
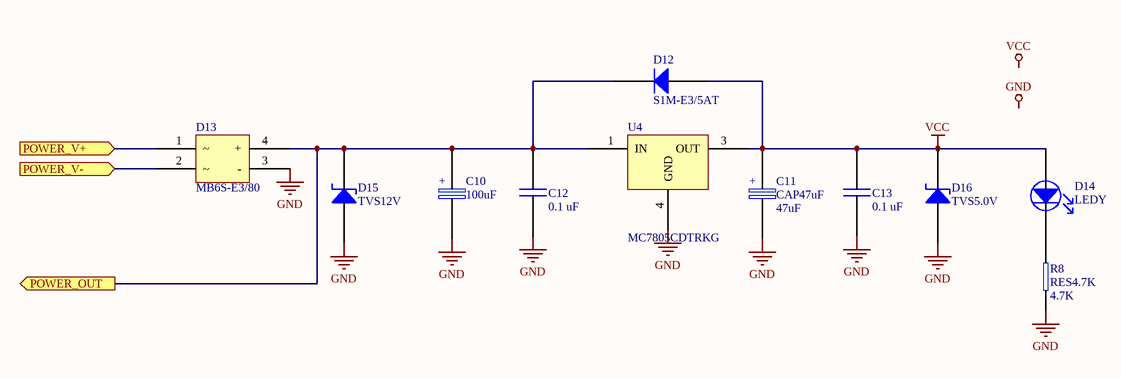
[diagram p9: Supply.SchDoc]

### Parts
C10  value 100uF  [EEH-ZA1E101XP]  (hidden comment: CAP100uF)
C11  CAP47uF  value 47uF  [EEH-ZA1E101XP]
C12  value 0.1 uF  [CAP0603]  (hidden comment: CAP0.1uF)
C13  value 0.1 uF  [CAP0603]  (hidden comment: CAP0.1uF)
D12  S1M-E3/5AT  [S1M-E3/5AT]
D13  MB6S-E3/80  [MB6S-E3/80]
D14  LEDY  [150060YS75000]
D15  TVS12V  [SMBJ5.0A]
D16  TVS5.0V  [SMBJ5.0A]
R8  RES4.7K  value 4.7K  [RES0603]
U4  MC7805CDTRKG  [MC7805CDTRKG]

### Ports
POWER_OUT (out), POWER_V+ (in), POWER_V- (in)

### Nets
GND: C10.2(neg) C11.2(neg) C12.2 C13.2 D13.3(-) D15.2(Anode) D16.2(Anode) R8.2(neg) U4.4(GND)
VCC: C11.1(pos) C13.1 D12.2(Anode) D14.2(Anode) D16.1(Cathode) U4.3(OUT)
EXTSUPP: C10.1(pos) C12.1 D12.1(Cathode) D13.4(+) D15.1(Cathode) U4.1(IN) ; port POWER_OUT
POWER_V+: D13.1 ; port POWER_V+
POWER_V-: D13.2 ; port POWER_V-
NetD14_1: D14.1(Cathode) R8.1(pos)

### Notes on the sheet
- Labels drawn without touching a wire or pin: GND, VCC
- (in symbol CAP47uF) +
- (in symbol CAP100uF) +

### Library data of the parts
C10 = CAP100uF: Capacitores de polímero orgánico de aluminio 100uF 25volts 6.3x7.7mm; Supplier: Mouser; Supplier PN: 667-EEH-ZA1E101XP; MPN: EEH-ZA1E101XP
C11 = CAP47uF: Capacitores de polímero orgánico de aluminio 25volts 47uF ESR 30mohm; MPN: 25SVPF47M; Supplier: Mouser; Supplier PN: 667-25SVPF47M
C12 C13 = C0.1UF: as C2 on sheet CPU; Supplier PN: 77-VJ0603Y104JXJPBC; Supplier: Mouser
D12 = S1M-E3/5AT: Rectificadores 1.0 Amp 1000 Volt 30A IFSM @ 8.3ms; Value: 1A; Supplier: Mouser; Supplier PN: 625-S1M-E3/5AT; MPN: S1M-E3/5AT
D13 = MB6S-E3/80: Rectificadores en puente 600 Volt 0.5 Amp 35 Amp IFSM; Value: 35V / 1A; MPN: MB6S-E3/80; Supplier: Mouser; Supplier PN: 625-MB6S-E3/80
D14 = LEDY: as D4 on sheet CPU; Supplier: Mouser; Supplier PN: 710-150060YS75000; MPN: 150060YS75000; Value: Yellow
D15 = TVS12V: Diodos TVS - Supresores de tensión transitoria 600W 12V 5% Uni; MPN: SMBJ12A-E3/52; Supplier: Mouser; Supplier PN: 625-SMBJ12A-E3; Value: 12 V
D16 = TVS5.0V: Diodos TVS - Supresores de tensión transitoria 5Vr 600W 65.3A 5% UniDirectional; Value: 5.0 V; Supplier: Mouser; Supplier PN: 576-SMBJ5.0A; MPN: SMBJ5.0A
R8 = RES4.7K: as R4 on sheet CPU; Supplier PN: 71-CRCW0603-4.7K-E3; Supplier: Mouser
U4 = MC7805CDTRKG: Reguladores de tensión lineal 5V 1A Postive; Value: 5.0 V / 1.0 A; Supplier: Mouser; Supplier PN: 863-MC7805CDTRKG; MPN: MC7805CDTRKG

## Nets that join several sheets
GND: CPU (13 pins), 485_CommunicactionInterface (C1.2 D1.3 R1.2 U1.5), SN54LS145N_CommunicationInterface (C14.2 U5.8), MATRIX/REG (C9_REG3.2 U3_REG3.8 U3_REG3.16), MATRIX/REG (C9_REG2.2 U3_REG2.8 U3_REG2.16), MATRIX/REG (C9_REG1.2 U3_REG1.8 U3_REG1.16), Supply (9 pins)
VCC: CPU (11 pins), 485_CommunicactionInterface (C1.1 D2.2 D3.2 U1.8), SN54LS145N_CommunicationInterface (C14.1 U5.16), MATRIX/REG (C9_REG3.1 U3_REG3.1 U3_REG3.7), MATRIX/REG (C9_REG2.1 U3_REG2.1 U3_REG2.7), MATRIX/REG (C9_REG1.1 U3_REG1.1 U3_REG1.7), Supply (6 pins)
A: 485_CommunicactionInterface (D1.1 U1.6), BUS/BUS (J1_BUS3.4), BUS/BUS (J1_BUS2.4)
B: 485_CommunicactionInterface (D1.2 U1.7), BUS/BUS (J1_BUS3.6), BUS/BUS (J1_BUS2.6)
CLK: CPU (P1.3 U2.3), MATRIX/REG (U3_REG3.15), MATRIX/REG (U3_REG2.15), MATRIX/REG (U3_REG1.15)
COM_485_EN: CPU (U2.14), 485_CommunicactionInterface (R1.1 U1.2 U1.3)
DI: CPU (U2.10), 485_CommunicactionInterface (R3.2 U1.4)
DOUT0: MATRIX/REG (U3_REG3.9), MATRIX/REG (U3_REG1.2)
DOUT1: MATRIX/REG (U3_REG2.2), MATRIX/REG (U3_REG1.9)
EXTSUPP: MATRIX/Row (Q1_Row7.3 R6_Row7.1), MATRIX/Row (Q1_Row6.3 R6_Row6.1), MATRIX/Row (Q1_Row5.3 R6_Row5.1), MATRIX/Row (Q1_Row4.3 R6_Row4.1), MATRIX/Row (Q1_Row3.3 R6_Row3.1), MATRIX/Row (Q1_Row2.3 R6_Row2.1), MATRIX/Row (Q1_Row1.3 R6_Row1.1), Supply (6 pins)
INPUT: CPU (P1.1 U2.1), MATRIX/REG (U3_REG3.2)
NetR9_2: RowDotMatrixControl (R9.2), MATRIX/REG (U3_REG3.3)
NetR10_2: RowDotMatrixControl (R10.2), MATRIX/REG (U3_REG1.3)
NetR11_2: RowDotMatrixControl (R11.2), MATRIX/REG (U3_REG3.4)
NetR12_2: RowDotMatrixControl (R12.2), MATRIX/REG (U3_REG1.4)
NetR13_2: RowDotMatrixControl (R13.2), MATRIX/REG (U3_REG3.5)
NetR14_2: RowDotMatrixControl (R14.2), MATRIX/REG (U3_REG1.5)
NetR15_2: RowDotMatrixControl (R15.2), MATRIX/REG (U3_REG3.6)
NetR16_2: RowDotMatrixControl (R16.2), MATRIX/REG (U3_REG1.6)
NetR17_2: RowDotMatrixControl (R17.2), MATRIX/REG (U3_REG3.11)
NetR18_2: RowDotMatrixControl (R18.2), MATRIX/REG (U3_REG1.11)
NetR19_2: RowDotMatrixControl (R19.2), MATRIX/REG (U3_REG3.12)
NetR20_2: RowDotMatrixControl (R20.2), MATRIX/REG (U3_REG1.12)
NetR21_2: RowDotMatrixControl (R21.2), MATRIX/REG (U3_REG3.13)
NetR22_2: RowDotMatrixControl (R22.2), MATRIX/REG (U3_REG1.13)
NetR23_2: RowDotMatrixControl (R23.2), MATRIX/REG (U3_REG3.14)
NetR24_2: RowDotMatrixControl (R24.2), MATRIX/REG (U3_REG1.14)
NetR25_2: RowDotMatrixControl (R25.2), MATRIX/REG (U3_REG2.3)
NetR26_2: RowDotMatrixControl (R26.2), MATRIX/REG (U3_REG2.4)
NetR27_2: RowDotMatrixControl (R27.2), MATRIX/REG (U3_REG2.5)
NetR28_2: RowDotMatrixControl (R28.2), MATRIX/REG (U3_REG2.6)
NetR29_2: RowDotMatrixControl (R29.2), MATRIX/REG (U3_REG2.11)
NetR30_2: RowDotMatrixControl (R30.2), MATRIX/REG (U3_REG2.12)
NetR31_2: RowDotMatrixControl (R31.2), MATRIX/REG (U3_REG2.13)
NetR32_2: RowDotMatrixControl (R32.2), MATRIX/REG (U3_REG2.14)
PIN_A: CPU (U2.30), SN54LS145N_CommunicationInterface (U5.15)
PIN_B: CPU (U2.31), SN54LS145N_CommunicationInterface (U5.14)
PIN_C: CPU (U2.32), SN54LS145N_CommunicationInterface (U5.13)
PIN_D: CPU (U2.33), SN54LS145N_CommunicationInterface (U5.12)
POWER_V+: BUS/BUS (J1_BUS3.1 J1_BUS3.2), BUS/BUS (J1_BUS2.1 J1_BUS2.2), Supply (D13.1)
POWER_V-: BUS/BUS (J1_BUS3.7 J1_BUS3.8), BUS/BUS (J1_BUS2.7 J1_BUS2.8), Supply (D13.2)
RCK: CPU (U2.37), MATRIX/REG (U3_REG3.10), MATRIX/REG (U3_REG2.10), MATRIX/REG (U3_REG1.10)
RES01: RowDotMatrixControl (R9.1), MATRIX/Row (D5_MATRIX_Row#1.K), MATRIX/Row (D5_MATRIX_Row#2.K), MATRIX/Row (D5_MATRIX_Row#3.K), MATRIX/Row (D5_MATRIX_Row#4.K), MATRIX/Row (D5_MATRIX_Row#5.K), MATRIX/Row (D5_MATRIX_Row#6.K), MATRIX/Row (D5_MATRIX_Row#7.K)
RES02: RowDotMatrixControl (R11.1), MATRIX/Row (D6_MATRIX_Row#1.K), MATRIX/Row (D6_MATRIX_Row#2.K), MATRIX/Row (D6_MATRIX_Row#3.K), MATRIX/Row (D6_MATRIX_Row#4.K), MATRIX/Row (D6_MATRIX_Row#5.K), MATRIX/Row (D6_MATRIX_Row#6.K), MATRIX/Row (D6_MATRIX_Row#7.K)
RES03: RowDotMatrixControl (R13.1), MATRIX/Row (D7_MATRIX_Row#1.K), MATRIX/Row (D7_MATRIX_Row#2.K), MATRIX/Row (D7_MATRIX_Row#3.K), MATRIX/Row (D7_MATRIX_Row#4.K), MATRIX/Row (D7_MATRIX_Row#5.K), MATRIX/Row (D7_MATRIX_Row#6.K), MATRIX/Row (D7_MATRIX_Row#7.K)
RES04: RowDotMatrixControl (R15.1), MATRIX/Row (D8_MATRIX_Row#1.K), MATRIX/Row (D8_MATRIX_Row#2.K), MATRIX/Row (D8_MATRIX_Row#3.K), MATRIX/Row (D8_MATRIX_Row#4.K), MATRIX/Row (D8_MATRIX_Row#5.K), MATRIX/Row (D8_MATRIX_Row#6.K), MATRIX/Row (D8_MATRIX_Row#7.K)
RES05: RowDotMatrixControl (R17.1), MATRIX/Row (D9_MATRIX_Row#1.K), MATRIX/Row (D9_MATRIX_Row#2.K), MATRIX/Row (D9_MATRIX_Row#3.K), MATRIX/Row (D9_MATRIX_Row#4.K), MATRIX/Row (D9_MATRIX_Row#5.K), MATRIX/Row (D9_MATRIX_Row#6.K), MATRIX/Row (D9_MATRIX_Row#7.K)
RES06: RowDotMatrixControl (R19.1), MATRIX/Row (D10_MATRIX_Row#1.K), MATRIX/Row (D10_MATRIX_Row#2.K), MATRIX/Row (D10_MATRIX_Row#3.K), MATRIX/Row (D10_MATRIX_Row#4.K), MATRIX/Row (D10_MATRIX_Row#5.K), MATRIX/Row (D10_MATRIX_Row#6.K), MATRIX/Row (D10_MATRIX_Row#7.K)
RES07: RowDotMatrixControl (R21.1), MATRIX/Row (D11_MATRIX_Row#1.K), MATRIX/Row (D11_MATRIX_Row#2.K), MATRIX/Row (D11_MATRIX_Row#3.K), MATRIX/Row (D11_MATRIX_Row#4.K), MATRIX/Row (D11_MATRIX_Row#5.K), MATRIX/Row (D11_MATRIX_Row#6.K), MATRIX/Row (D11_MATRIX_Row#7.K)
RES08: RowDotMatrixControl (R23.1), MATRIX/Row (D17_MATRIX_Row#1.K), MATRIX/Row (D17_MATRIX_Row#2.K), MATRIX/Row (D17_MATRIX_Row#3.K), MATRIX/Row (D17_MATRIX_Row#4.K), MATRIX/Row (D17_MATRIX_Row#5.K), MATRIX/Row (D17_MATRIX_Row#6.K), MATRIX/Row (D17_MATRIX_Row#7.K)
RES11: RowDotMatrixControl (R25.1), MATRIX/Row (D26_MATRIX_Row#1.K), MATRIX/Row (D26_MATRIX_Row#2.K), MATRIX/Row (D26_MATRIX_Row#3.K), MATRIX/Row (D26_MATRIX_Row#4.K), MATRIX/Row (D26_MATRIX_Row#5.K), MATRIX/Row (D26_MATRIX_Row#6.K), MATRIX/Row (D26_MATRIX_Row#7.K)
RES12: RowDotMatrixControl (R26.1), MATRIX/Row (D27_MATRIX_Row#1.K), MATRIX/Row (D27_MATRIX_Row#2.K), MATRIX/Row (D27_MATRIX_Row#3.K), MATRIX/Row (D27_MATRIX_Row#4.K), MATRIX/Row (D27_MATRIX_Row#5.K), MATRIX/Row (D27_MATRIX_Row#6.K), MATRIX/Row (D27_MATRIX_Row#7.K)
RES13: RowDotMatrixControl (R27.1), MATRIX/Row (D28_MATRIX_Row#1.K), MATRIX/Row (D28_MATRIX_Row#2.K), MATRIX/Row (D28_MATRIX_Row#3.K), MATRIX/Row (D28_MATRIX_Row#4.K), MATRIX/Row (D28_MATRIX_Row#5.K), MATRIX/Row (D28_MATRIX_Row#6.K), MATRIX/Row (D28_MATRIX_Row#7.K)
RES14: RowDotMatrixControl (R28.1), MATRIX/Row (D29_MATRIX_Row#1.K), MATRIX/Row (D29_MATRIX_Row#2.K), MATRIX/Row (D29_MATRIX_Row#3.K), MATRIX/Row (D29_MATRIX_Row#4.K), MATRIX/Row (D29_MATRIX_Row#5.K), MATRIX/Row (D29_MATRIX_Row#6.K), MATRIX/Row (D29_MATRIX_Row#7.K)
RES15: RowDotMatrixControl (R29.1), MATRIX/Row (D30_MATRIX_Row#1.K), MATRIX/Row (D30_MATRIX_Row#2.K), MATRIX/Row (D30_MATRIX_Row#3.K), MATRIX/Row (D30_MATRIX_Row#4.K), MATRIX/Row (D30_MATRIX_Row#5.K), MATRIX/Row (D30_MATRIX_Row#6.K), MATRIX/Row (D30_MATRIX_Row#7.K)
RES16: RowDotMatrixControl (R30.1), MATRIX/Row (D31_MATRIX_Row#1.K), MATRIX/Row (D31_MATRIX_Row#2.K), MATRIX/Row (D31_MATRIX_Row#3.K), MATRIX/Row (D31_MATRIX_Row#4.K), MATRIX/Row (D31_MATRIX_Row#5.K), MATRIX/Row (D31_MATRIX_Row#6.K), MATRIX/Row (D31_MATRIX_Row#7.K)
RES17: RowDotMatrixControl (R31.1), MATRIX/Row (D32_MATRIX_Row#1.K), MATRIX/Row (D32_MATRIX_Row#2.K), MATRIX/Row (D32_MATRIX_Row#3.K), MATRIX/Row (D32_MATRIX_Row#4.K), MATRIX/Row (D32_MATRIX_Row#5.K), MATRIX/Row (D32_MATRIX_Row#6.K), MATRIX/Row (D32_MATRIX_Row#7.K)
RES18: RowDotMatrixControl (R32.1), MATRIX/Row (D33_MATRIX_Row#1.K), MATRIX/Row (D33_MATRIX_Row#2.K), MATRIX/Row (D33_MATRIX_Row#3.K), MATRIX/Row (D33_MATRIX_Row#4.K), MATRIX/Row (D33_MATRIX_Row#5.K), MATRIX/Row (D33_MATRIX_Row#6.K), MATRIX/Row (D33_MATRIX_Row#7.K)
RES21: RowDotMatrixControl (R10.1), MATRIX/Row (D18_MATRIX_Row#1.K), MATRIX/Row (D18_MATRIX_Row#2.K), MATRIX/Row (D18_MATRIX_Row#3.K), MATRIX/Row (D18_MATRIX_Row#4.K), MATRIX/Row (D18_MATRIX_Row#5.K), MATRIX/Row (D18_MATRIX_Row#6.K), MATRIX/Row (D18_MATRIX_Row#7.K)
RES22: RowDotMatrixControl (R12.1), MATRIX/Row (D19_MATRIX_Row#1.K), MATRIX/Row (D19_MATRIX_Row#2.K), MATRIX/Row (D19_MATRIX_Row#3.K), MATRIX/Row (D19_MATRIX_Row#4.K), MATRIX/Row (D19_MATRIX_Row#5.K), MATRIX/Row (D19_MATRIX_Row#6.K), MATRIX/Row (D19_MATRIX_Row#7.K)
RES23: RowDotMatrixControl (R14.1), MATRIX/Row (D20_MATRIX_Row#1.K), MATRIX/Row (D20_MATRIX_Row#2.K), MATRIX/Row (D20_MATRIX_Row#3.K), MATRIX/Row (D20_MATRIX_Row#4.K), MATRIX/Row (D20_MATRIX_Row#5.K), MATRIX/Row (D20_MATRIX_Row#6.K), MATRIX/Row (D20_MATRIX_Row#7.K)
RES24: RowDotMatrixControl (R16.1), MATRIX/Row (D21_MATRIX_Row#1.K), MATRIX/Row (D21_MATRIX_Row#2.K), MATRIX/Row (D21_MATRIX_Row#3.K), MATRIX/Row (D21_MATRIX_Row#4.K), MATRIX/Row (D21_MATRIX_Row#5.K), MATRIX/Row (D21_MATRIX_Row#6.K), MATRIX/Row (D21_MATRIX_Row#7.K)
RES25: RowDotMatrixControl (R18.1), MATRIX/Row (D22_MATRIX_Row#1.K), MATRIX/Row (D22_MATRIX_Row#2.K), MATRIX/Row (D22_MATRIX_Row#3.K), MATRIX/Row (D22_MATRIX_Row#4.K), MATRIX/Row (D22_MATRIX_Row#5.K), MATRIX/Row (D22_MATRIX_Row#6.K), MATRIX/Row (D22_MATRIX_Row#7.K)
RES26: RowDotMatrixControl (R20.1), MATRIX/Row (D23_MATRIX_Row#1.K), MATRIX/Row (D23_MATRIX_Row#2.K), MATRIX/Row (D23_MATRIX_Row#3.K), MATRIX/Row (D23_MATRIX_Row#4.K), MATRIX/Row (D23_MATRIX_Row#5.K), MATRIX/Row (D23_MATRIX_Row#6.K), MATRIX/Row (D23_MATRIX_Row#7.K)
RES27: RowDotMatrixControl (R22.1), MATRIX/Row (D24_MATRIX_Row#1.K), MATRIX/Row (D24_MATRIX_Row#2.K), MATRIX/Row (D24_MATRIX_Row#3.K), MATRIX/Row (D24_MATRIX_Row#4.K), MATRIX/Row (D24_MATRIX_Row#5.K), MATRIX/Row (D24_MATRIX_Row#6.K), MATRIX/Row (D24_MATRIX_Row#7.K)
RES28: RowDotMatrixControl (R24.1), MATRIX/Row (D25_MATRIX_Row#1.K), MATRIX/Row (D25_MATRIX_Row#2.K), MATRIX/Row (D25_MATRIX_Row#3.K), MATRIX/Row (D25_MATRIX_Row#4.K), MATRIX/Row (D25_MATRIX_Row#5.K), MATRIX/Row (D25_MATRIX_Row#6.K), MATRIX/Row (D25_MATRIX_Row#7.K)
RO: CPU (U2.9), 485_CommunicactionInterface (R2.2 U1.1)
Row0: SN54LS145N_CommunicationInterface (U5.1), MATRIX/Row (R6_Row1.2 R7_Row1.1)
Row1: SN54LS145N_CommunicationInterface (U5.2), MATRIX/Row (R6_Row2.2 R7_Row2.1)
Row2: SN54LS145N_CommunicationInterface (U5.3), MATRIX/Row (R6_Row3.2 R7_Row3.1)
Row3: SN54LS145N_CommunicationInterface (U5.4), MATRIX/Row (R6_Row4.2 R7_Row4.1)
Row4: SN54LS145N_CommunicationInterface (U5.5), MATRIX/Row (R6_Row5.2 R7_Row5.1)
Row5: SN54LS145N_CommunicationInterface (U5.6), MATRIX/Row (R6_Row6.2 R7_Row6.1)
Row6: SN54LS145N_CommunicationInterface (U5.7), MATRIX/Row (R6_Row7.2 R7_Row7.1)